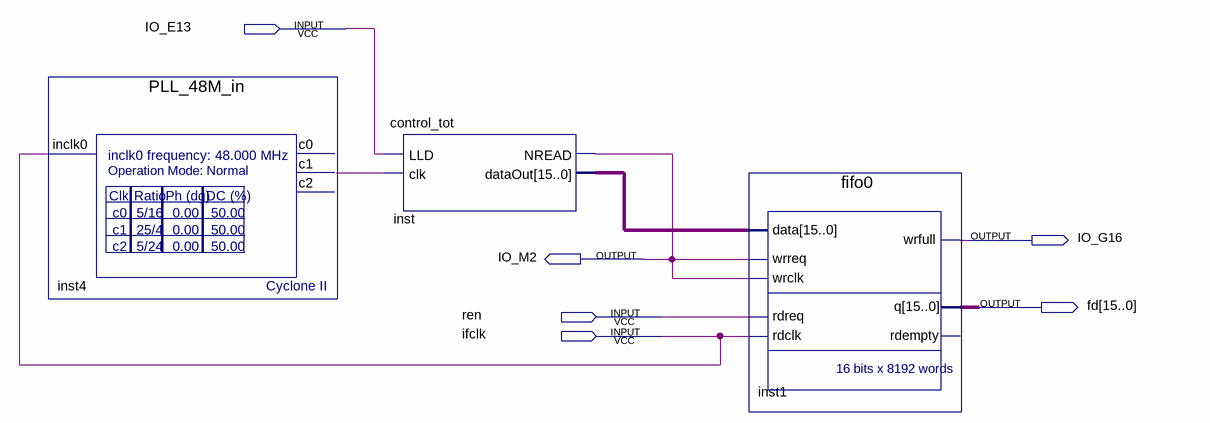
[diagram p0: schematic sheet]
// Quartus schematic Template.bdf as structural Verilog: 3 symbols, 6 pins
module Template (
  input  IO_E13,
  input  ren,
  input  ifclk,
  output IO_G16,
  output IO_M2,
  output [15:0] fd
);

  wire inst4_c1;
  wire [15:0] inst_dataout;

  PLL_48M_in inst4 (.inclk0(ifclk), .c1(inst4_c1));  // open: c0, c2
  control_tot inst (.LLD(IO_E13), .clk(inst4_c1), .NREAD(IO_M2), .dataOut(inst_dataout));
  fifo0 inst1 (
    .data(inst_dataout), .wrreq(IO_M2), .wrclk(IO_M2), .rdreq(ren), .rdclk(ifclk), .wrfull(IO_G16), .q(fd));  // open: rdempty
endmodule
